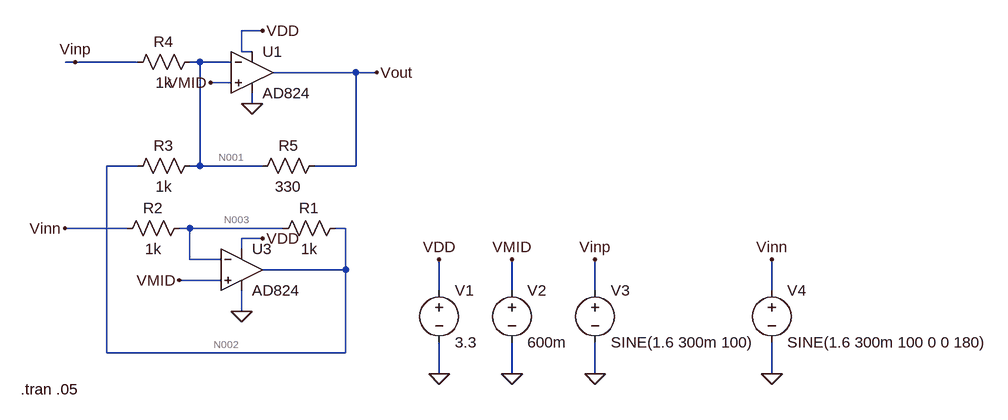
[diagram p0: schematic Draft1.asc]
Draft1.asc, the LTspice schematic file:
Version 4
SHEET 1 1320 680
WIRE 176 64 144 64
WIRE 144 96 144 64
WIRE 160 96 144 96
WIRE -112 112 -128 112
WIRE -16 112 -112 112
WIRE 80 112 64 112
WIRE 128 112 80 112
WIRE 320 128 192 128
WIRE 352 128 320 128
WIRE 128 144 96 144
WIRE 160 176 160 160
WIRE -16 272 -64 272
WIRE 80 272 80 112
WIRE 80 272 64 272
WIRE 176 272 80 272
WIRE 320 272 320 128
WIRE 320 272 256 272
WIRE -32 368 -128 368
WIRE 64 368 48 368
WIRE 208 368 64 368
WIRE 304 368 288 368
WIRE 176 384 144 384
WIRE 144 400 144 384
WIRE 64 416 64 368
WIRE 112 416 64 416
WIRE 304 432 304 368
WIRE 304 432 176 432
WIRE 112 448 48 448
WIRE 448 464 448 416
WIRE 560 464 560 416
WIRE 688 464 688 416
WIRE 960 464 960 416
WIRE 144 496 144 464
WIRE -64 560 -64 272
WIRE 304 560 304 432
WIRE 304 560 -64 560
WIRE 448 592 448 544
WIRE 560 592 560 544
WIRE 688 592 688 544
WIRE 960 592 960 544
FLAG 176 384 VDD
FLAG 144 496 0
FLAG 160 176 0
FLAG -112 112 Vinp
FLAG -128 368 Vinn
FLAG 176 64 VDD
FLAG 352 128 Vout
FLAG 448 592 0
FLAG 448 416 VDD
FLAG 560 592 0
FLAG 96 144 VMID
FLAG 48 448 VMID
FLAG 560 416 VMID
FLAG 688 592 0
FLAG 688 416 Vinp
FLAG 960 592 0
FLAG 960 416 Vinn
SYMBOL res 304 352 R90
WINDOW 0 0 56 VBottom 2
WINDOW 3 32 56 VTop 2
SYMATTR InstName R1
SYMATTR Value 1k
SYMBOL res 64 352 R90
WINDOW 0 0 56 VBottom 2
WINDOW 3 32 56 VTop 2
SYMATTR InstName R2
SYMATTR Value 1k
SYMBOL res 80 256 R90
WINDOW 0 0 56 VBottom 2
WINDOW 3 32 56 VTop 2
SYMATTR InstName R3
SYMATTR Value 1k
SYMBOL res 80 96 R90
WINDOW 0 0 56 VBottom 2
WINDOW 3 32 56 VTop 2
SYMATTR InstName R4
SYMATTR Value 1k
SYMBOL res 272 256 R90
WINDOW 0 0 56 VBottom 2
WINDOW 3 32 56 VTop 2
SYMATTR InstName R5
SYMATTR Value 330
SYMBOL voltage 448 448 R0
WINDOW 123 0 0 Left 0
WINDOW 39 0 0 Left 0
SYMATTR InstName V1
SYMATTR Value 3.3
SYMBOL voltage 560 448 R0
WINDOW 123 0 0 Left 0
WINDOW 39 0 0 Left 0
SYMATTR InstName V2
SYMATTR Value 600m
SYMBOL voltage 688 448 R0
WINDOW 123 0 0 Left 0
WINDOW 39 0 0 Left 0
SYMATTR InstName V3
SYMATTR Value SINE(1.6 300m 100)
SYMBOL voltage 960 448 R0
WINDOW 123 0 0 Left 0
WINDOW 39 0 0 Left 0
SYMATTR InstName V4
SYMATTR Value SINE(1.6 300m 100 0 0 180)
SYMBOL Opamps\\AD824 144 368 R0
SYMATTR InstName U3
SYMBOL Opamps\\AD824 160 64 R0
SYMATTR InstName U1
TEXT -196 616 Left 2 !.tran .05

The netlist it stands for:
* Draft1.asc
R1 N002 N003 1k
R2 N003 Vinn 1k
R3 N001 N002 1k
R4 N001 Vinp 1k
R5 Vout N001 330
V1 VDD 0 3.3
V2 VMID 0 600m
V3 Vinp 0 SINE(1.6 300m 100)
V4 Vinn 0 SINE(1.6 300m 100 0 0 180)
XU3 VMID N003 VDD 0 N002 AD824  ; pins In+ In- V+ V- OUT
XU1 VMID N001 VDD 0 Vout AD824  ; pins In+ In- V+ V- OUT
.tran .05
.backanno
.end

* Results of the author's LTspice run, read from the files saved beside the schematic
* Operating Point, zero values left out:
*   V(n002) = 52.16 mV
*   V(n003) = 826.1 mV
*   V(vinn) = 1.6 V
*   V(n001) = 600 mV
*   V(vinp) = 1.6 V
*   V(vout) = 450.8 mV
*   V(vdd) = 3.3 V
*   V(vmid) = 600 mV
*   I(R5) = -452.1 µA
*   I(R4) = -1 mA
*   I(R3) = 547.8 µA
*   I(R2) = -773.9 µA
*   I(R1) = -773.9 µA
*   I(V4) = -773.9 µA
*   I(V3) = -1 mA
*   I(V2) = -3.878 pA
*   I(V1) = -697.6 µA
*   Ix(u3:1) = 1.931 pA
*   Ix(u3:2) = 1.976 pA
*   Ix(u3:3) = 347.6 µA
*   Ix(u3:4) = -1.672 mA
*   Ix(u3:5) = 1.322 mA
*   Ix(u1:1) = 1.947 pA
*   Ix(u1:2) = 1.948 pA
*   Ix(u1:3) = 349.9 µA
*   Ix(u1:4) = -802.1 µA
*   Ix(u1:5) = 452.1 µA
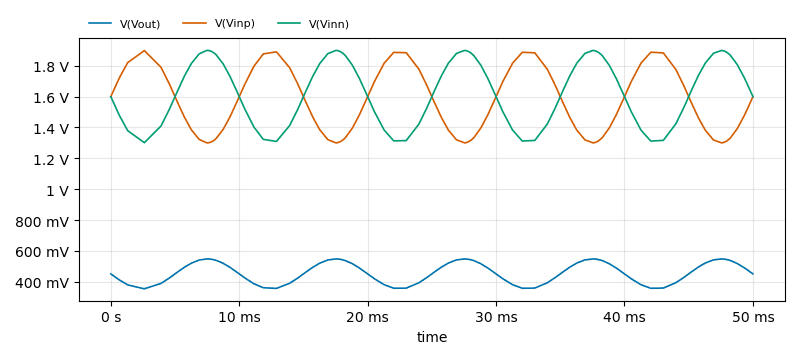
[diagram p1: Transient Analysis of Draft1.asc, plotted from the saved traces]
* Transient Analysis, 1 run:
*   V(Vout): min 354.2 mV, max 547.9 mV, average 451.4 mV, rms 456.6 mV, last 450.8 mV
*   V(Vinp): min 1.3 V, max 1.899 V, average 1.598 V, rms 1.612 V, last 1.6 V
*   V(Vinn): min 1.301 V, max 1.9 V, average 1.602 V, rms 1.616 V, last 1.6 V